# Altium schematic sheet csi.SchDoc
size A3; DocumentNumber: 1; SheetNumber: 1; SheetTotal: 6; PageSetup: Record=PageOptions|CenterHorizontal=True|CenterVertical=True|PrintScale=0.97|XCorrection=1.00|YCorrection=1.00|PrintKind=1|BorderSize=5000000|LeftOffset=0|BottomOffset=0|Orientation=2|PaperLength=2970|PaperWidth=2100|Scale=100|PaperSource=7|PrintQuality=600|MediaType=1|DitherType=10|PaperKind=A4|PrintScaleMode=1
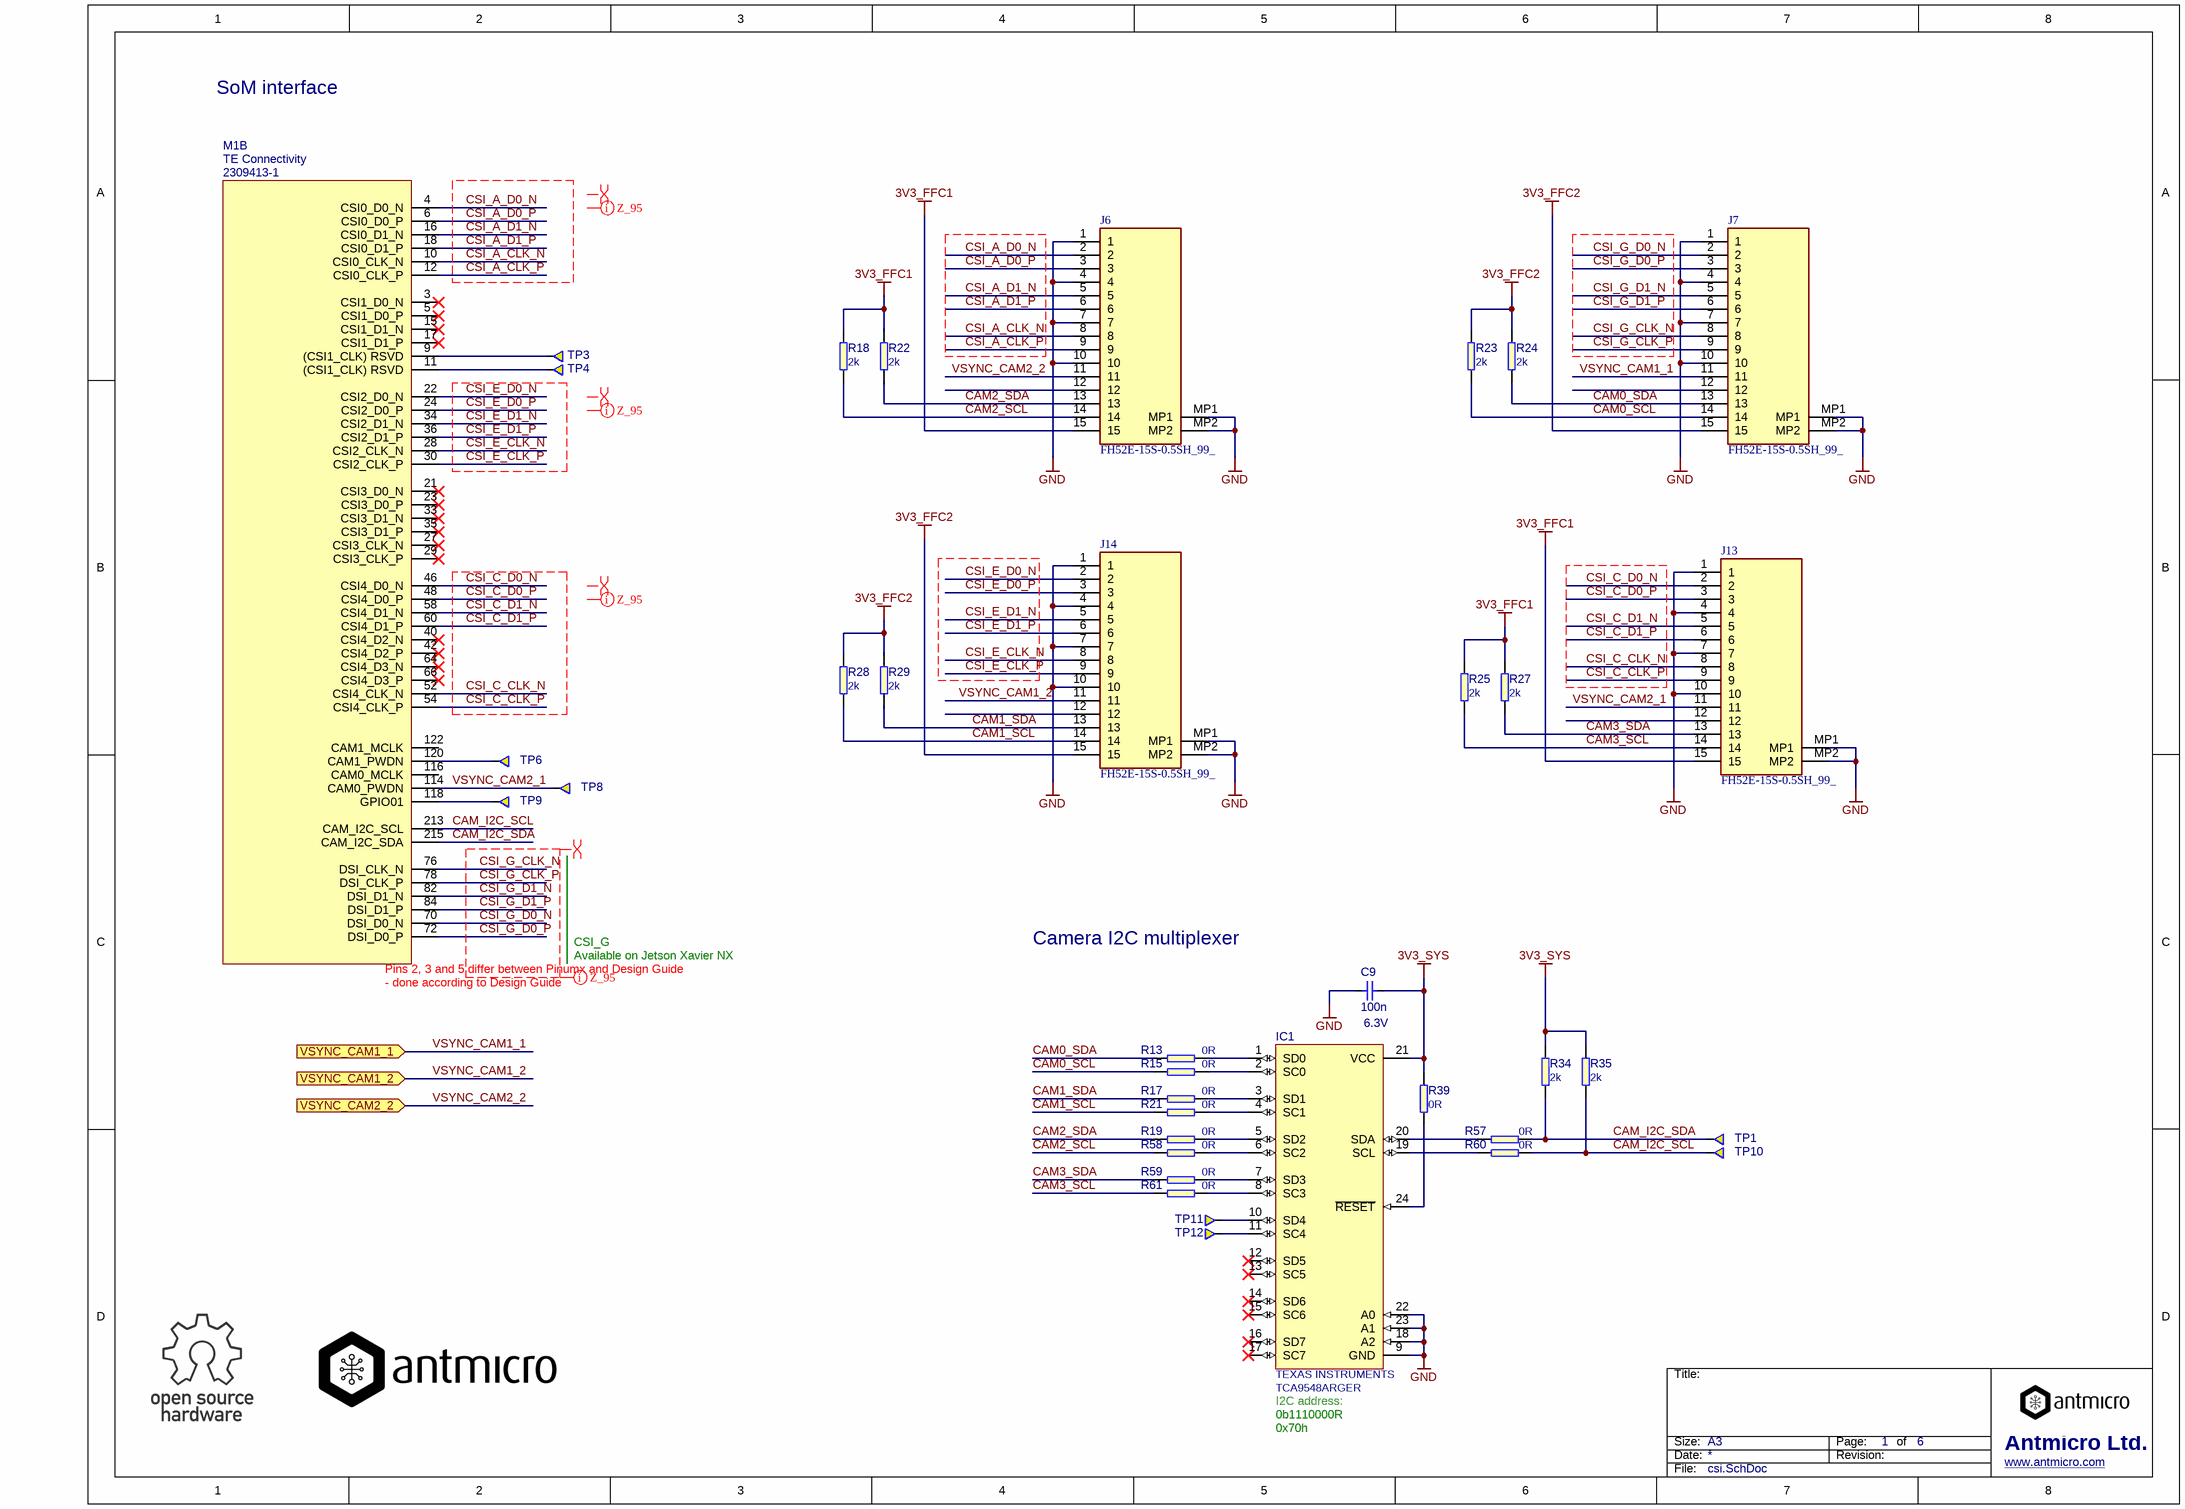
[diagram p0: csi.SchDoc]

## Parts
C9  Voltage: 6.3V  [0402]  (hidden comment: 100n)
IC1  TCA9548ARGER  Manufacturer: TEXAS INSTRUMENTS  [VQFN-24]
J6  FH52E-15S-0.5SH_99_  [FH52E15S05SH99]
J7  FH52E-15S-0.5SH_99_  [FH52E15S05SH99]
J13  FH52E-15S-0.5SH_99_  [FH52E15S05SH99]
J14  FH52E-15S-0.5SH_99_  [FH52E15S05SH99]
M1  Manufacturer: TE Connectivity  [jetson-nano-connector]  (hidden comment: 2309413-1)  (part B of 7)
R13  0R  [0402]
R15  0R  [0402]
R17  0R  [0402]
R18  2k  [0402]
R19  0R  [0402]
R21  0R  [0402]
R22  2k  [0402]
R23  2k  [0402]
R24  2k  [0402]
R25  2k  [0402]
R27  2k  [0402]
R28  2k  [0402]
R29  2k  [0402]
R34  2k  [0402]
R35  2k  [0402]
R39  0R  [0402]
R57  0R  [0402]
R58  0R  [0402]
R59  0R  [0402]
R60  0R  [0402]
R61  0R  [0402]
TP1  Testpad  [TP-R-1.5]  (value not drawn)  (no BOM)
TP3  Testpad  [TP-R-1.5]  (value not drawn)  (no BOM)
TP4  Testpad  [TP-R-1.5]  (value not drawn)  (no BOM)
TP6  Testpad  [TP-R-1.5]  (value not drawn)  (no BOM)
TP8  Testpad  [TP-R-1.5]  (value not drawn)  (no BOM)
TP9  Testpad  [TP-R-1.5]  (value not drawn)  (no BOM)
TP10  Testpad  [TP-R-1.5]  (value not drawn)  (no BOM)
TP11  Testpad  [TP-R-1.5]  (value not drawn)  (no BOM)
TP12  Testpad  [TP-R-1.5]  (value not drawn)  (no BOM)

## Ports
VSYNC_CAM1_1 (in), VSYNC_CAM1_2 (in), VSYNC_CAM2_2 (in)

## Nets
3V3_FFC1: J6.15 J13.15 R18.1 R22.1 R25.1 R27.1
3V3_FFC2: J7.15 J14.15 R23.1 R24.1 R28.1 R29.1
3V3_SYS: C9.2 IC1.21(VCC) R34.1 R35.1 R39.2
GND: C9.1 IC1.9(GND) IC1.18(A2) IC1.22(A0) IC1.23(A1) J6.1 J6.4 J6.7 J6.10 J6.MP1 J6.MP2 J7.1 J7.4 J7.7 J7.10 J7.MP1 J7.MP2 J13.1 J13.4 J13.7 J13.10 J13.MP1 J13.MP2 J14.1 J14.4 J14.7 J14.10 J14.MP1 J14.MP2
CAM0_SCL: J7.14 R15.1 R23.2
CAM0_SDA: J7.13 R13.1 R24.2
CAM1_SCL: J14.14 R21.1 R28.2
CAM1_SDA: J14.13 R17.1 R29.2
CAM2_SCL: J6.14 R18.2 R58.1
CAM2_SDA: J6.13 R19.1 R22.2
CAM3_SCL: J13.14 R25.2 R61.1
CAM3_SDA: J13.13 R27.2 R59.1
CAM_I2C_SCL: M1.213(CAM_I2C_SCL) R35.2 R60.2 TP10.1
CAM_I2C_SDA: M1.215(CAM_I2C_SDA) R34.2 R57.2 TP1.1
CSI_A_CLK_N: J6.8 M1.10(CSI0_CLK_N)
CSI_A_CLK_P: J6.9 M1.12(CSI0_CLK_P)
CSI_A_D0_N: J6.2 M1.4(CSI0_D0_N)
CSI_A_D0_P: J6.3 M1.6(CSI0_D0_P)
CSI_A_D1_N: J6.5 M1.16(CSI0_D1_N)
CSI_A_D1_P: J6.6 M1.18(CSI0_D1_P)
CSI_C_CLK_N: J13.8 M1.52(CSI4_CLK_N)
CSI_C_CLK_P: J13.9 M1.54(CSI4_CLK_P)
CSI_C_D0_N: J13.2 M1.46(CSI4_D0_N)
CSI_C_D0_P: J13.3 M1.48(CSI4_D0_P)
CSI_C_D1_N: J13.5 M1.58(CSI4_D1_N)
CSI_C_D1_P: J13.6 M1.60(CSI4_D1_P)
CSI_E_CLK_N: J14.8 M1.28(CSI2_CLK_N)
CSI_E_CLK_P: J14.9 M1.30(CSI2_CLK_P)
CSI_E_D0_N: J14.2 M1.22(CSI2_D0_N)
CSI_E_D0_P: J14.3 M1.24(CSI2_D0_P)
CSI_E_D1_N: J14.5 M1.34(CSI2_D1_N)
CSI_E_D1_P: J14.6 M1.36(CSI2_D1_P)
CSI_G_CLK_N: J7.8 M1.76(DSI_CLK_N)
CSI_G_CLK_P: J7.9 M1.78(DSI_CLK_P)
CSI_G_D0_N: J7.2 M1.70(DSI_D0_N)
CSI_G_D0_P: J7.3 M1.72(DSI_D0_P)
CSI_G_D1_N: J7.5 M1.82(DSI_D1_N)
CSI_G_D1_P: J7.6 M1.84(DSI_D1_P)
VSYNC_CAM1_1: J7.11 ; port VSYNC_CAM1_1
VSYNC_CAM1_2: J14.11 ; port VSYNC_CAM1_2
VSYNC_CAM2_1: J13.11 M1.114(CAM0_PWDN) TP8.1
VSYNC_CAM2_2: J6.11 ; port VSYNC_CAM2_2
NetIC1_1: IC1.1(SD0) R13.2
NetIC1_2: IC1.2(SC0) R15.2
NetIC1_3: IC1.3(SD1) R17.2
NetIC1_4: IC1.4(SC1) R21.2
NetIC1_5: IC1.5(SD2) R19.2
NetIC1_6: IC1.6(SC2) R58.2
NetIC1_7: IC1.7(SD3) R59.2
NetIC1_8: IC1.8(SC3) R61.2
NetIC1_10: IC1.10(SD4) TP11.1
NetIC1_11: IC1.11(SC4) TP12.1
NetIC1_19: IC1.19(SCL) R60.1
NetIC1_20: IC1.20(SDA) R57.1
NetIC1_24: IC1.24(~{RESET}) R39.1
NetM1_9: M1.9((CSI1_CLK)_RSVD) TP3.1
NetM1_11: M1.11((CSI1_CLK)_RSVD) TP4.1
NetM1_118: M1.118(GPIO01) TP9.1
NetM1_120: M1.120(CAM1_PWDN) TP6.1

Not connected (* = marked no-connect by the designer): IC1 12(SD5)* 13(SC5)* 14(SD6)* 15(SC6)* 16(SD7)* 17(SC7)*; J6 12; J7 12; J13 12; J14 12; M1 3(CSI1_D0_N)* 5(CSI1_D0_P)* 15(CSI1_D1_N)* 17(CSI1_D1_P)* 21(CSI3_D0_N)* 23(CSI3_D0_P)* 27(CSI3_CLK_N)* 29(CSI3_CLK_P)* 33(CSI3_D1_N)* 35(CSI3_D1_P)* 40(CSI4_D2_N)* 42(CSI4_D2_P)* 64(CSI4_D3_N)* 66(CSI4_D3_P)* 116(CAM0_MCLK) 122(CAM1_MCLK)

## Layout directives
differential pair: (no net found under the mark), CSI_G_CLK_N, CSI_G_CLK_P, CSI_G_D0_N, CSI_G_D0_P, CSI_G_D1_N, CSI_G_D1_P
net class Z_95: (no net found under the mark), CSI_G_CLK_N, CSI_G_CLK_P, CSI_G_D0_N, CSI_G_D0_P, CSI_G_D1_N, CSI_G_D1_P

## Notes on the sheet
- SoM interface
- CSI_G
- Available on Jetson Xavier NX
- Camera I2C multiplexer
- 0x70h
- 0b1110000R
- (near IC1) I2C address:
- Title:
- Size:
- Date:
- A3
- Revision:
- Page:
- of
- Antmicro Ltd.
- File:
- www.antmicro.com
- (in symbol jetson-nano-new-release, part B) Pins 2, 3 and 5 differ between Pinumx and Design Guide; - done according to Design Guide

## Library data of the parts
C9 = C_100n_0402: MLCC SMT Capacitor 100n 0402; Manufacturer: TDK; PartSymbol: C1005X5R0J104K050BA; Value: 100n; PartNumber: C_100n_0402
IC1 = TCA9548A: TCA9548ARGER  I2C SWITCH W/ RESET, 8-CH, VQFN-24; Value: TCA9548ARGER; PartNumber: TCA9548ARGER; PartSymbol: TCA9548ARGER
J6 J7 J13 J14 = FH52E-15S-0.5SH_99_: Connector; Manufacturer_Name: Hirose; Manufacturer_Part_Number: FH52E-15S-0.5SH(99); Description: FFC & FPC Connectors 0.5MM 15P LNG MTL FITNG SMT VERT MNT; Datasheet Link: https://componentsearchengine.com/Datasheets/1/FH52E-15S-0.5SH(99).pdf; Height: 2.2mm
M1 = jetson-nano-new-release: PartNumber: 2309413-1; PartSymbol: 2309413-1; Value: 2309413-1
R13 R15 R17 R19 R21 R39 R57-R61 = R_0R_0402: RES, 0R, 0402; Manufacturer: Panasonic; PartSymbol: ERJ2GE0R00X; Value: 0R; PartNumber: R_0R_0402
R18 R22-R25 R27-R29 R34 R35 = R_2k_0402: RES, 2k, 0402; Manufacturer: VISHAY; PartSymbol: CRCW04022K00FKED; PartNumber: R_2k_0402; Value: 2k
TP1 TP3 TP4 TP6 TP8-TP12 = Testpad: Testpad, round, 1.5mm; PartNumber: TP-R-1.5